# EasyEDA schematic Esquemático_circuito.json
TITLE: Circuito nodo sensor micro:bit; REV: 1.0; Date: 2022-10-03; Sheet: 1/1; Company: ESCOM
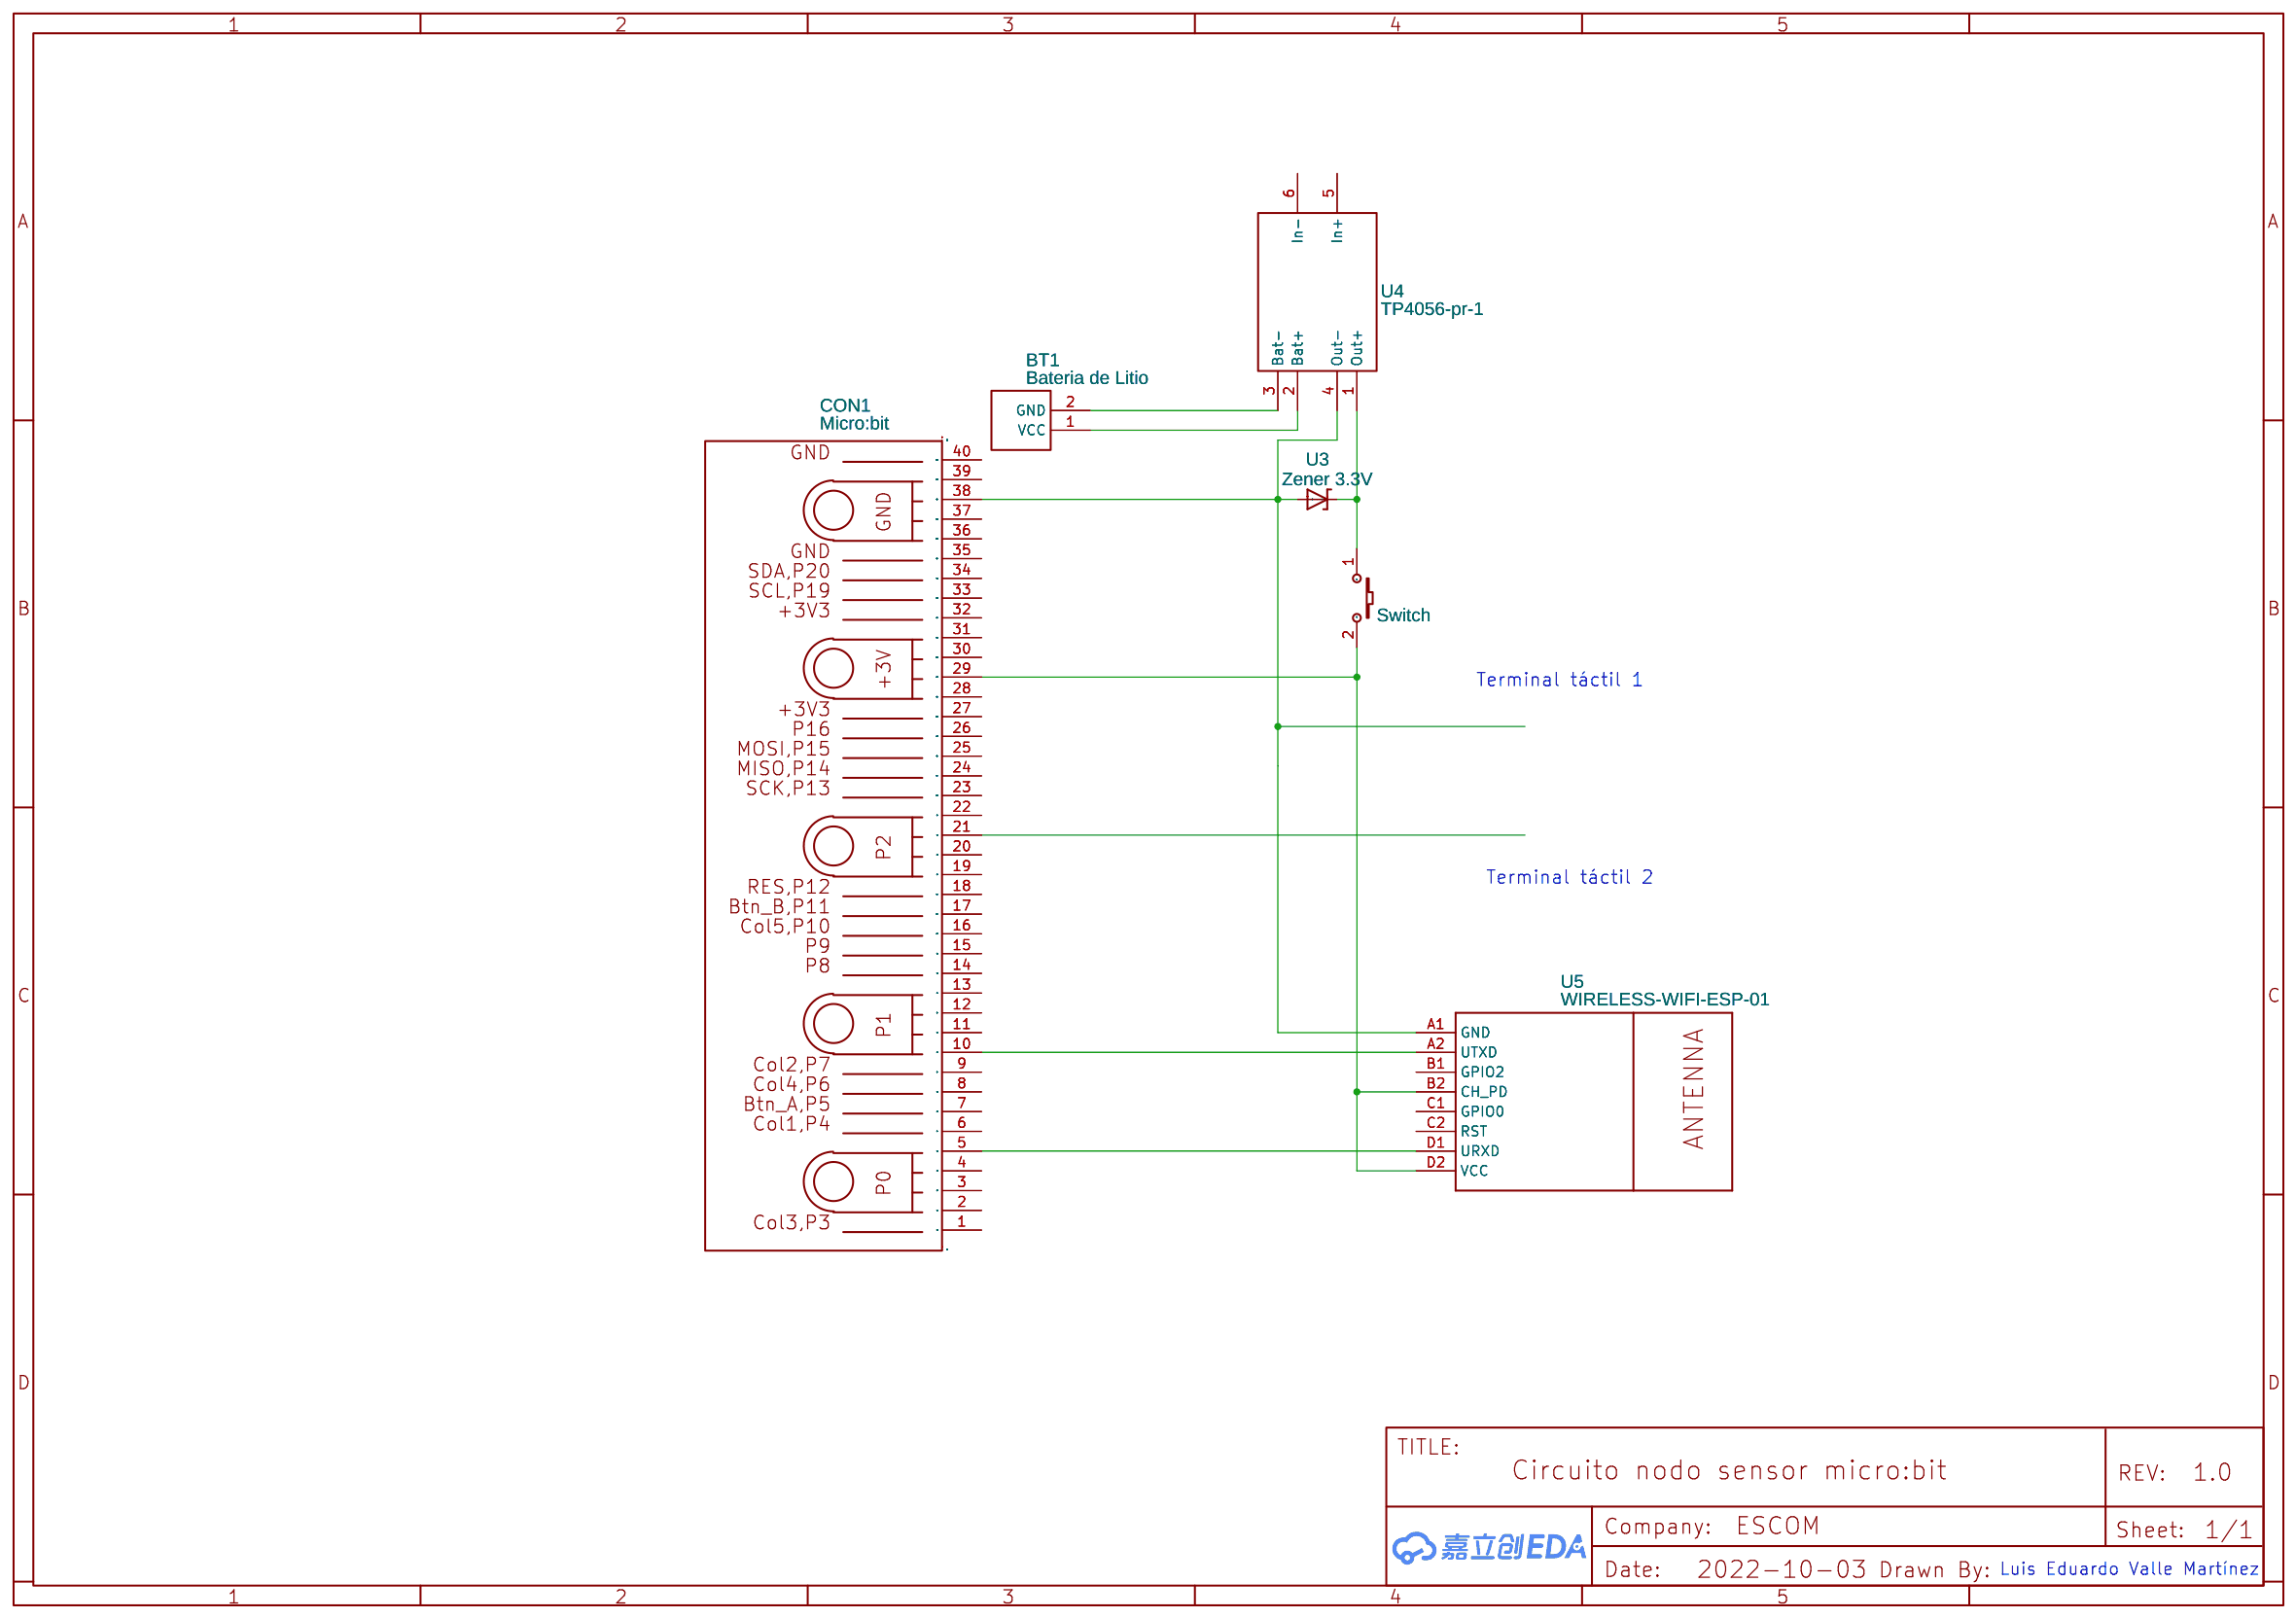
[diagram p0: schematic sheet]

## Parts
BT1  Bateria de Litio  [59MMX33MM]
CON1  Micro:bit  [CYLCONN-MICROBIT-V2-EDGE-40P-180DEG]
KEY1  Switch  [KEY-SMD_2P-L6.2-W3.6-LS8.0]
U3  Zener 3.3V  [DIODE-ZENER]
U4  TP4056-pr-1  [TP4056-PROTECTED]
U5  WIRELESS-WIFI-ESP-01  [WIRELESS-WIFI-ESP-01]

## Library data of the parts
BT1 = No.52Section side by side battery box: Supplier: LCSC; Manufacturer: ReliaPro; Supplier Part: C5404; JLCPCB Part Class: Extended Part
CON1 = CYLCONN-MICROBIT-V2-EDGE-40P-180DEG_1
KEY1 = K2-3.6×6.1_SMD: Supplier Part: C118141; Supplier: LCSC; Manufacturer Part: K2-1107ST-A4SW-06; Contributor: LCEDA_Lib; 制造商: 韩国韩荣
U3 = DIODE-ZENER: Contributor: SparkFun
U4 = TP4056-pr-1: Contributor: michael1967
U5 = WIRELESS-WIFI-ESP-01: Wireless Wi-Fi ESP-01 Module based on ESP8266 chip

## Nets
Net-(BT1-1): BT1.1(VCC) U4.2(Bat+)
Net-(BT1-2): BT1.2(GND) U4.3(Bat-)
Net-(CON1-5): CON1.5(P0) U5.D1(URXD)
Net-(CON1-10): CON1.10(P1) U5.A2(UTXD)
Net-(CON1-29): CON1.29(+3V3) KEY1.2 U5.B2(CH_PD) U5.D2(VCC)
Net-(CON1-38): CON1.38(GND) U3.P$2(A) U4.4(Out-) U5.A1(GND)
Net-(KEY1-1): KEY1.1 U3.P$1(C) U4.1(Out+)

Not connected (* = marked no-connect by the designer): CON1 1(P3) 2(P0) 3(P0) 4(P0) 6(P4) 7(P5) 8(P6) 9(P7) 11(P1) 12(P1) 13(P1) 14(P8) 15(P9) 16(P10) 17(P11) 18(P12) 19(P2) 20(P2) 21(P2) 22(P2) 23(P13) 24(P14) 25(P15) 26(P16) 27(+3V3) 28(+3V3) 30(+3V3) 31(+3V3) 32(+3V3) 33(P19) 34(P20) 35(GND) 36(GND) 37(GND) 39(GND) 40(GND) 41(NC41) 42(NC42); U4 5(In+) 6(In-); U5 B1(GPIO2) C1(GPIO0) C2(RST)

## Notes on the sheet
- Terminal táctil 1
- Terminal táctil 2
- Luis Eduardo Valle Martínez
